# Altium project 4_Layer_GoldenArduino.PrjPcb
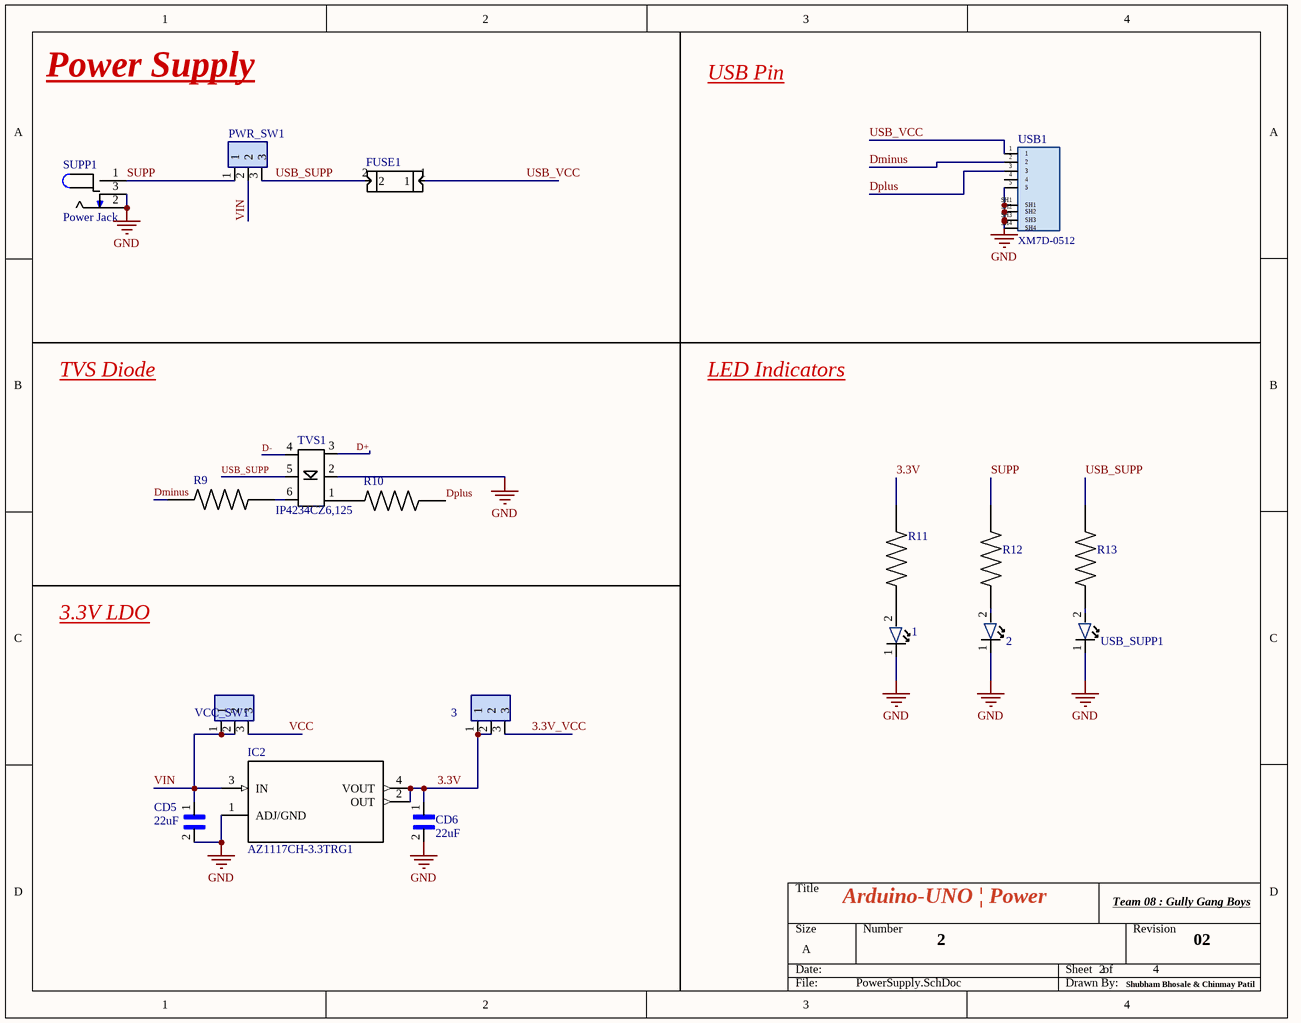
[diagram p0: PowerSupply.SchDoc]
4 sheets, 77 parts. Net scope: global (net labels, ports and power ports of the same name join across sheets).
Board file: PCB.PcbDoc
Sheets:
  PowerSupply.SchDoc
  Atmega328.SchDoc
  FTDIChip.SchDoc
  Sensors.SchDoc

## Sheet PowerSupply.SchDoc
size A

### Parts
1  LTST-C150CKT  [LED]  (value not drawn)
2  LTST-C150CKT  [LED]  (value not drawn)
3  PREC003SAAN-RC  [3_PIN]  (value not drawn)
CD5  22uF  [1206_Passive]
CD6  22uF  [1206_Passive]
FUSE1  MF-MSMF050-2  [FUSE]  (value not drawn)
IC2  AZ1117CH-3.3TRG1  [LDO]
PWR_SW1  PREC003SAAN-RC  [3_PIN]  (value not drawn)
R9  RMCF1206JT300R‎  [1206_Passive]  (value not drawn)
R10  RMCF1206JT300R‎  [1206_Passive]  (value not drawn)
R11  RNCP1206FTD1K00  [1206_Passive]  (value not drawn)
R12  RNCP1206FTD1K00  [1206_Passive]  (value not drawn)
R13  RNCP1206FTD1K00  [1206_Passive]  (value not drawn)
SUPP1  Power Jack  [Power_Jack]
TVS1  IP4234CZ6,125  [TVS]
USB1  XM7D-0512  [USB]
USB_SUPP1  LTST-C150CKT  [LED]  (value not drawn)
VCC_SW1  PREC003SAAN-RC  [3_PIN]  (value not drawn)

### Nets
3.3V_VCC: 3.3
GND: 1.1 2.1 CD5.2 CD6.2 IC2.1(ADJ/GND) SUPP1.2 SUPP1.3 TVS1.2 USB1.5 USB1.SH1 USB1.SH2 USB1.SH3 USB1.SH4 USB_SUPP1.1
VCC: VCC_SW1.3
3.3V: 3.1 3.2 CD6.1 IC2.2(OUT) IC2.4(VOUT) R11.2
D+: TVS1.3
D-: TVS1.4
Dminus: R9.1 USB1.2
Dplus: R10.2 USB1.3
SUPP: PWR_SW1.1 R12.1 SUPP1.1
USB_SUPP: FUSE1.2 PWR_SW1.3 R13.1 TVS1.5
USB_VCC: FUSE1.1 USB1.1
VIN: CD5.1 IC2.3(IN) PWR_SW1.2 VCC_SW1.1 VCC_SW1.2
Net1_2: 1.2 R11.1
Net2_2: 2.2 R12.2
NetR9_2: R9.2 TVS1.6
NetR10_1: R10.1 TVS1.1
NetR13_2: R13.2 USB_SUPP1.2

Not connected (* = marked no-connect by the designer): USB1 4

### Notes on the sheet
- Power Supply
- USB Pin
- TVS Diode
- LED Indicators
- 3.3V LDO
- Arduino-UNO | Power
- Team 08 : Gully Gang Boys
- 2
- 4
- 02
- Shubham Bhosale & Chinmay Patil

### Library data of the parts
1 2 USB_SUPP1 = 1206_RED_LED: Red 638nm LED Indication - Discrete 1.8V 1206 (3216 Metric); Value: LED RED CLEAR 1206 SMD; Digikey Link: https://www.digikey.com/product-detail/en/LTST-C150CKT/160-1167-1-ND/269239/?itemSeq=304982368; Digikey Part: 160-1167-1-ND
3 PWR_SW1 VCC_SW1 = 3_PIN: Connector Header Through Hole 3 position 0.100" (2.54mm); Value: CONN HEADER VERT 3POS 2.54MM; Digikey Link: https://www.digikey.com/product-detail/en/PREC003SAAN-RC/S1012EC-03-ND/2774851/?itemSeq=304982371; Digikey Part: S1012EC-03-ND
CD5 CD6 = 1206_22uF: 22µF ±20% 16V Ceramic Capacitor X5R 1206 (3216 Metric); Value: CAP CER 22UF 16V X5R 1206; Digikey Link: https://www.digikey.com/product-detail/en/CL31A226MOCLNNC/1276-2728-1-ND/3890814/?itemSeq=304982363; Digikey Part: 1276-2728-1-ND
FUSE1 = Fuse: Polymeric PTC Resettable Fuse 15V 500mA Ih Surface Mount 1812 (4532 Metric), Concave; Value: PTC RESET FUSE 15V 500MA 1812; Digikey Link: https://www.digikey.com/product-detail/en/MF-MSMF050-2/MF-MSMF050-2CT-ND/662842/?itemSeq=304982360; Digikey Part: MF-MSMF050-2CT-ND
IC2 = 3.3V_LDO: Linear Voltage Regulator IC Positive Fixed 1 Output 1A SOT-223; Value: IC REG LINEAR 3.3V 800MA SOT223; Digikey Link: https://www.digikey.com/product-detail/en/AZ1117CH-3.3TRG1/AZ1117CH-3.3TRG1DICT-ND/4505206/?itemSeq=304982370; Digikey Part: AZ1117CH-3.3TRG1DICT-ND
R9 R10 = 1206_300Ohm: 300 Ohms ±5% 0.25W, 1/4W Chip Resistor 1206 (3216 Metric) Automotive AEC-Q200 Thick Film; Value: 300Ohm; Digikey Link: https://www.digikey.com/product-detail/en/RMCF1206JT300R/RMCF1206JT300RCT-ND/1942776/?itemSeq=304982374; Digikey Part: RMCF1206JT300RCT-ND
R11-R13 = 1206_1K: 1 kOhms ±1% 0.5W, 1/2W Chip Resistor 1206 (3216 Metric) Anti-Sulfur, Moisture Resistant Thin Film; Value: RES 1K OHM 1% 1/2W 1206; Digikey Link: https://www.digikey.com/product-detail/en/RNCP1206FTD1K00/RNCP1206FTD1K00CT-ND/2240675/?itemSeq=304982373; Digikey Part: RNCP1206FTD1K00CT-ND
SUPP1 = Power Jack: Power Barrel Connector Jack 2.10mm ID (0.083"), 5.50mm OD (0.217") Through Hole, Right Angle; Value: CONN PWR JACK 2X5.5MM SOLDER; Digikey Link: https://www.digikey.com/product-detail/en/PJ-102A/CP-102A-ND/275425/?itemSeq=304982367; Digikey Part: CP-102A-ND
TVS1 = TVS_Diode: Clamp Ipp Tvs Diode Surface Mount 6-TSOP; Value: TVS DIODE 5.5V 6TSOP; Digikey Part: 1727-4717-1-ND; Digikey Link: https://www.digikey.com/product-detail/en/IP4234CZ6%2c125/1727-4717-1-ND/2531156/?itemSeq=304982369
USB1 = USB: USB - mini B USB 2.0 Receptacle Connector 5 Position Through Hole, Right Angle; Value: CONN RCPT USB2.0 MINI B 5P R/A; Digikey Link: https://www.digikey.com/product-detail/en/XM7D-0512/OR1205-ND/4695531/?itemSeq=304982356; Digikey Part: OR1205-ND

## Sheet Atmega328.SchDoc
size A
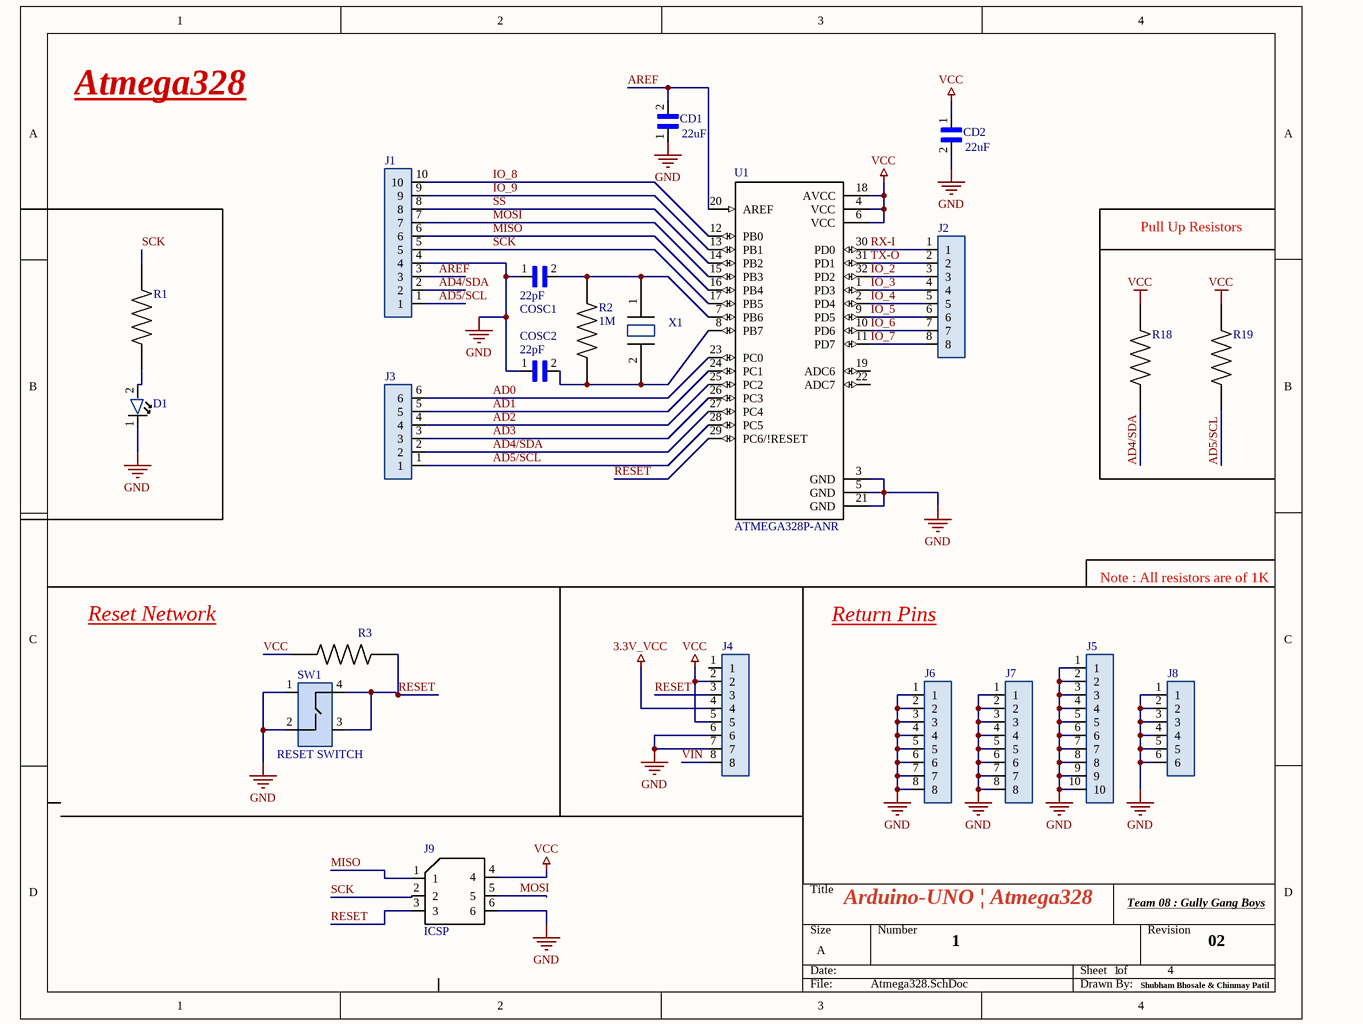
[diagram p1: Atmega328.SchDoc]

### Parts
CD1  22uF  [1206_Passive]
CD2  22uF  [1206_Passive]
COSC1  22pF  [1206_Passive]
COSC2  22pF  [1206_Passive]
D1  LTST-C150CKT  [LED]  (value not drawn)
J1  PPTC101LFBN-RC  [10_PIN]  (value not drawn)
J2  PPTC081LFBN-RC  [8_PIN]  (value not drawn)
J3  PPTC061LFBN-RC  [6_PIN]  (value not drawn)
J4  PPTC081LFBN-RC  [8_PIN]  (value not drawn)
J5  PPTC101LFBN-RC  [10_PIN]  (value not drawn)
J6  PPTC081LFBN-RC  [8_PIN]  (value not drawn)
J7  PPTC081LFBN-RC  [8_PIN]  (value not drawn)
J8  PPTC061LFBN-RC  [6_PIN]  (value not drawn)
J9  ICSP  [ICSP]
R1  RNCP1206FTD1K00  [1206_Passive]  (value not drawn)
R2  1M  [1206_Passive]
R3  RNCP1206FTD1K00  [1206_Passive]  (value not drawn)
R18  RNCP1206FTD1K00  [1206_Passive]  (value not drawn)
R19  RNCP1206FTD1K00  [1206_Passive]  (value not drawn)
SW1  RESET SWITCH  [Switch]
U1  ATMEGA328P-ANR  [ATMega328P]
X1  ABLS-16.000MHZ-B4-T  [Crystal]  (value not drawn)

### Nets
3.3V_VCC: J4.4
GND: CD1.1 CD2.2 COSC1.1 COSC2.1 D1.1 J1.4 J4.6 J4.7 J5.1 J5.2 J5.3 J5.4 J5.5 J5.6 J5.7 J5.8 J5.9 J5.10 J6.1 J6.2 J6.3 J6.4 J6.5 J6.6 J6.7 J6.8 J7.1 J7.2 J7.3 J7.4 J7.5 J7.6 J7.7 J7.8 J8.1 J8.2 J8.3 J8.4 J8.5 J8.6 J9.6 SW1.1 SW1.2 U1.3(GND) U1.5(GND) U1.21(GND)
VCC: CD2.1 J4.2 J4.5 J9.4 R3.1 R18.2 R19.2 U1.4(VCC) U1.6(VCC) U1.18(AVCC)
AD0: J3.6 U1.23(PC0)
AD1: J3.5 U1.24(PC1)
AD2: J3.4 U1.25(PC2)
AD3: J3.3 U1.26(PC3)
AD4/SDA: J1.2 J3.2 R18.1 U1.27(PC4)
AD5/SCL: J1.1 J3.1 R19.1 U1.28(PC5)
AREF: CD1.2 J1.3 U1.20(AREF)
IO_2: J2.3 U1.32(PD2)
IO_3: J2.4 U1.1(PD3)
IO_4: J2.5 U1.2(PD4)
IO_5: J2.6 U1.9(PD5)
IO_6: J2.7 U1.10(PD6)
IO_7: J2.8 U1.11(PD7)
IO_8: J1.10 U1.12(PB0)
IO_9: J1.9 U1.13(PB1)
MISO: J1.6 J9.1 U1.16(PB4)
MOSI: J1.7 J9.5 U1.15(PB3)
RESET: J4.3 J9.3 R3.2 SW1.3 SW1.4 U1.29(PC6/!RESET)
RX-I: J2.1 U1.30(PD0)
SCK: J1.5 J9.2 R1.2 U1.17(PB5)
SS: J1.8 U1.14(PB2)
TX-O: J2.2 U1.31(PD1)
VIN: J4.8
NetCOSC1_2: COSC1.2 R2.2 U1.7(PB6) X1.1
NetCOSC2_2: COSC2.2 R2.1 U1.8(PB7) X1.2
NetD1_2: D1.2 R1.1

Not connected (* = marked no-connect by the designer): J4 1; U1 19(ADC6) 22(ADC7)

### Notes on the sheet
- Atmega328
- Pull Up Resistors
- Reset Network
- Return Pins
- Note : All resistors are of 1K
- Arduino-UNO | Atmega328
- Team 08 : Gully Gang Boys
- 1
- 4
- 02
- Shubham Bhosale & Chinmay Patil

### Library data of the parts
CD1 CD2 = 1206_22uF: as CD5 on sheet PowerSupply; Digikey Link: https://www.digikey.com/product-detail/en/CL31A226MOCLNNC/1276-2728-1-ND/3890814/?itemSeq=304982363; Digikey Part: 1276-2728-1-ND
COSC1 COSC2 = 1206_22pF: 22pF ±5% 16V Ceramic Capacitor C0G, NP0 1206 (3216 Metric); Value: CAP CER 22PF 16V C0G/NP0 1206; Digikey Link: https://www.digikey.com/product-detail/en/885012008011/732-7867-1-ND/5454494/?itemSeq=304982362; Digikey Part: 732-7867-1-ND
D1 = 1206_RED_LED: as 1 on sheet PowerSupply; Digikey Link: https://www.digikey.com/product-detail/en/LTST-C150CKT/160-1167-1-ND/269239/?itemSeq=304982368; Digikey Part: 160-1167-1-ND
J1 J5 = 10_PIN_FEMALE: 10 Position Header Connector 0.100" (2.54mm) Through Hole Tin; Value: CONN HDR 10POS 0.1 TIN PCB; Digikey Link: https://www.digikey.com/product-detail/en/PPTC101LFBN-RC/S7008-ND/810149/?itemSeq=304982352; Digikey Part: S7008-ND
J2 J4 J6 J7 = 8_PIN_FEMALE: 8 Position Header Connector 0.100" (2.54mm) Through Hole Tin; Value: CONN HDR 8POS 0.1 TIN PCB; Digikey Link: https://www.digikey.com/product-detail/en/PPTC081LFBN-RC/S7006-ND/810147/?itemSeq=304982354; Digikey Part: S7006-ND
J3 J8 = 6_PIN_FEMALE: 6 Position Header Connector 0.100" (2.54mm) Through Hole Tin; Value: CONN HDR 6POS 0.1 TIN PCB; Digikey Link: https://www.digikey.com/product-detail/en/PPTC061LFBN-RC/S7004-ND/810145/?itemSeq=304982353; Digikey Part: S7004-ND
J9 = ICSP: Connector Header Through Hole 6 position 0.079" (2.00mm); Value: NRPN032PAEN-RC; Digikey Link: https://www.digikey.com/product-detail/en/NRPN032PAEN-RC/S5801-03-ND/804955/?itemSeq=304982355; Digikey Part: S5801-03-ND
R1 R3 R18 R19 = 1206_1K: as R11 on sheet PowerSupply; Digikey Link: https://www.digikey.com/product-detail/en/RNCP1206FTD1K00/RNCP1206FTD1K00CT-ND/2240675/?itemSeq=304982373; Digikey Part: RNCP1206FTD1K00CT-ND
R2 = 1206_1M: 1 MOhms ±5% 0.25W, 1/4W Chip Resistor 1206 (3216 Metric) Automotive AEC-Q200 Thick Film; Value: RES 1M OHM 5% 1/4W 1206; Digikey Link: https://www.digikey.com/product-detail/en/RMCF1206JT1M00/RMCF1206JT1M00CT-ND/1942830/?itemSeq=304982358; Digikey Part: Number RMCF1206JT1M00CT-ND
SW1 = Push_Button: Tactile Switch SPST-NO Top Actuated Surface Mount; Value: SWITCH TACTILE SPST-NO 50MA 12V; Digikey Link: https://www.digikey.com/product-detail/en/TL3305AF160QG/EG5350CT-ND/5816195/?itemSeq=304982361; Digikey Part: EG5350CT-ND
U1 = ATMega328P: AVR AVR® ATmega Microcontroller IC 8-Bit 20MHz 32KB (16K x 16) FLASH 32-TQFP (7x7); Value: IC MCU 8BIT 32KB FLASH 32TQFP; Digikey Link: https://www.digikey.com/product-detail/en/ATMEGA328P-ANR/ATMEGA328P-ANRCT-ND/2774230/?itemSeq=304982365; Digikey Part: ATMEGA328P-ANRCT-ND
X1 = 16MHz_Crystal: 16MHz ±30ppm Crystal 18pF 40 Ohms HC-49/US; Value: CRYSTAL 16.0000MHZ 18PF SMD; Digikey Link: https://www.digikey.com/product-detail/en/ABLS-16.000MHZ-B4-T/535-10226-1-ND/2184261/?itemSeq=304982364; Digikey Part: 535-10226-1-ND

## Sheet FTDIChip.SchDoc
size A
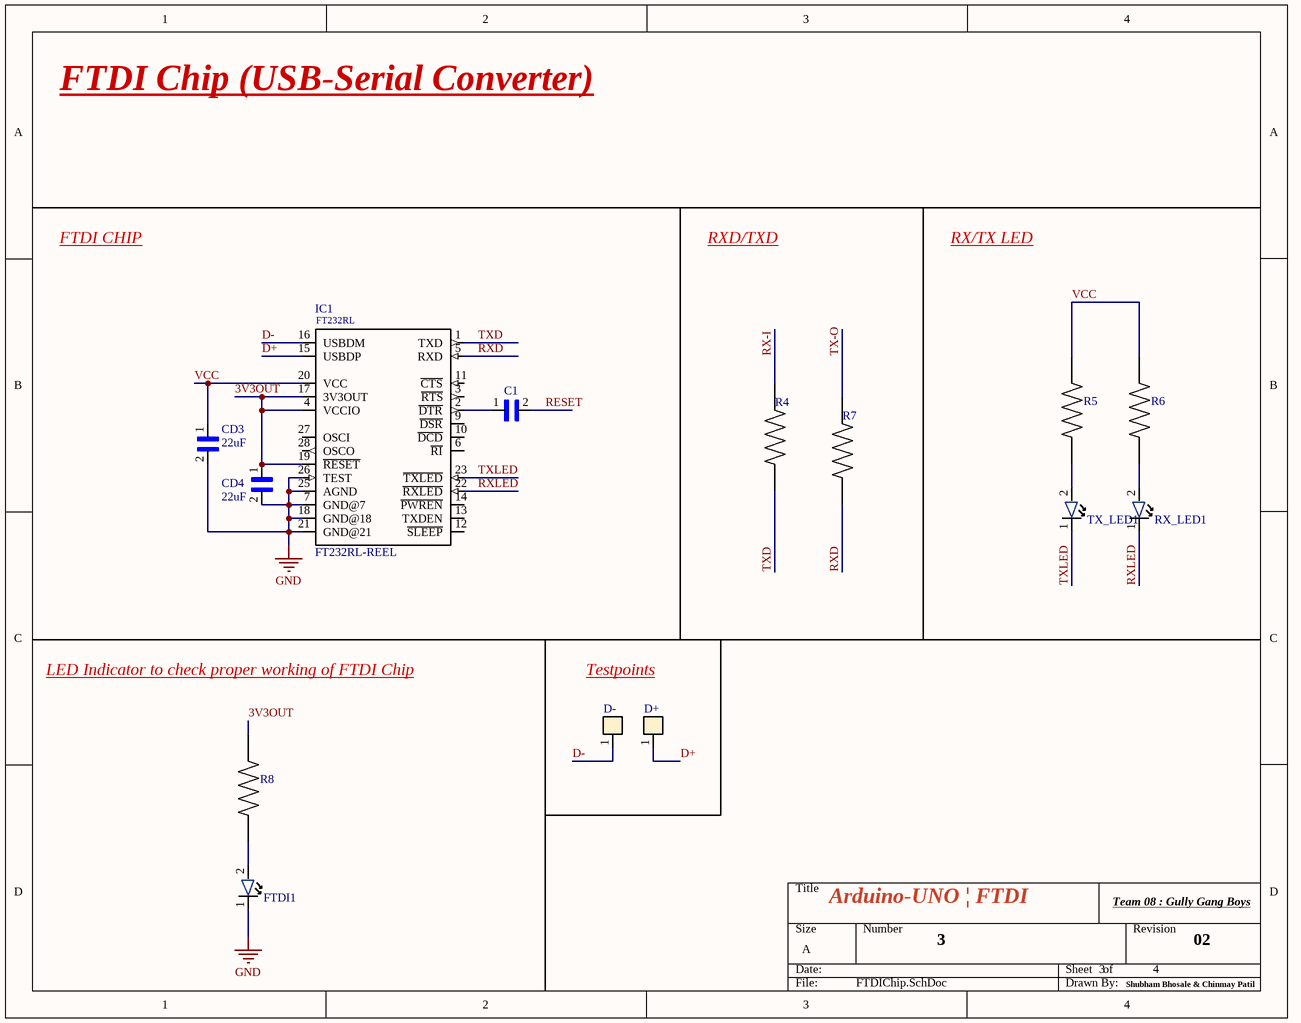
[diagram p2: FTDIChip.SchDoc]

### Parts
C1  CL31A226MOCLNNC  [1206_Passive]  (value not drawn)
CD3  22uF  [1206_Passive]
CD4  22uF  [1206_Passive]
D+  TESTPOINT  [TestPoint]  (value not drawn)
D-  TESTPOINT  [TestPoint]  (value not drawn)
FTDI1  LTST-C150CKT  [LED]  (value not drawn)
IC1  FT232RL-REEL  [FTDI]
R4  RNCP1206FTD1K00  [1206_Passive]  (value not drawn)
R5  RNCP1206FTD1K00  [1206_Passive]  (value not drawn)
R6  RNCP1206FTD1K00  [1206_Passive]  (value not drawn)
R7  RNCP1206FTD1K00  [1206_Passive]  (value not drawn)
R8  RNCP1206FTD1K00  [1206_Passive]  (value not drawn)
RX_LED1  LTST-C150CKT  [LED]  (value not drawn)
TX_LED1  LTST-C150CKT  [LED]  (value not drawn)

### Nets
GND: CD3.2 CD4.2 FTDI1.1 IC1.7(GND@7) IC1.18(GND@18) IC1.21(GND@21) IC1.25(AGND) IC1.26(TEST)
VCC: CD3.1 IC1.20(VCC) R5.1 R6.1
3V3OUT: CD4.1 IC1.4(VCCIO) IC1.17(3V3OUT) IC1.19(~{RESET}) R8.1
D+: D+.1 IC1.15(USBDP)
D-: D-.1 IC1.16(USBDM)
RESET: C1.2
RX-I: R4.2
RXD: IC1.5(RXD) R7.1
RXLED: IC1.22(~{RXLED}) RX_LED1.1
TX-O: R7.2
TXD: IC1.1(TXD) R4.1
TXLED: IC1.23(~{TXLED}) TX_LED1.1
NetC1_1: C1.1 IC1.2(~{DTR})
NetFTDI1_2: FTDI1.2 R8.2
NetR5_2: R5.2 TX_LED1.2
NetR6_2: R6.2 RX_LED1.2

Not connected (* = marked no-connect by the designer): IC1 3(~{RTS}) 6(~{RI}) 9(~{DSR}) 10(~{DCD}) 11(~{CTS}) 12(~{SLEEP}) 13(TXDEN) 14(~{PWREN}) 27(OSCI) 28(OSCO)

### Notes on the sheet
- FTDI Chip (USB-Serial Converter)
- FTDI CHIP
- RXD/TXD
- RX/TX LED
- LED Indicator to check proper working of FTDI Chip
- Testpoints
- Arduino-UNO | FTDI
- Team 08 : Gully Gang Boys
- 3
- 4
- 02
- Shubham Bhosale & Chinmay Patil
- (in symbol FTDI) FT232RL

### Library data of the parts
C1 CD3 CD4 = 1206_22uF: as CD5 on sheet PowerSupply; Digikey Link: https://www.digikey.com/product-detail/en/CL31A226MOCLNNC/1276-2728-1-ND/3890814/?itemSeq=304982363; Digikey Part: 1276-2728-1-ND
FTDI1 RX_LED1 TX_LED1 = 1206_RED_LED: as 1 on sheet PowerSupply; Digikey Link: https://www.digikey.com/product-detail/en/LTST-C150CKT/160-1167-1-ND/269239/?itemSeq=304982368; Digikey Part: 160-1167-1-ND
IC1 = FTDI: USB Bridge, USB to UART USB 2.0 UART Interface 28-SSOP; Value: IC USB FS SERIAL UART 28-SSOP; Digikey Part: 768-1007-1-ND; Digikey Link: https://www.digikey.com/product-detail/en/FT232RL-REEL/768-1007-1-ND/1836402/?itemSeq=304982359
R4-R8 = 1206_1K: as R11 on sheet PowerSupply; Digikey Link: https://www.digikey.com/product-detail/en/RNCP1206FTD1K00/RNCP1206FTD1K00CT-ND/2240675/?itemSeq=304982373; Digikey Part: RNCP1206FTD1K00CT-ND

## Sheet Sensors.SchDoc
size A
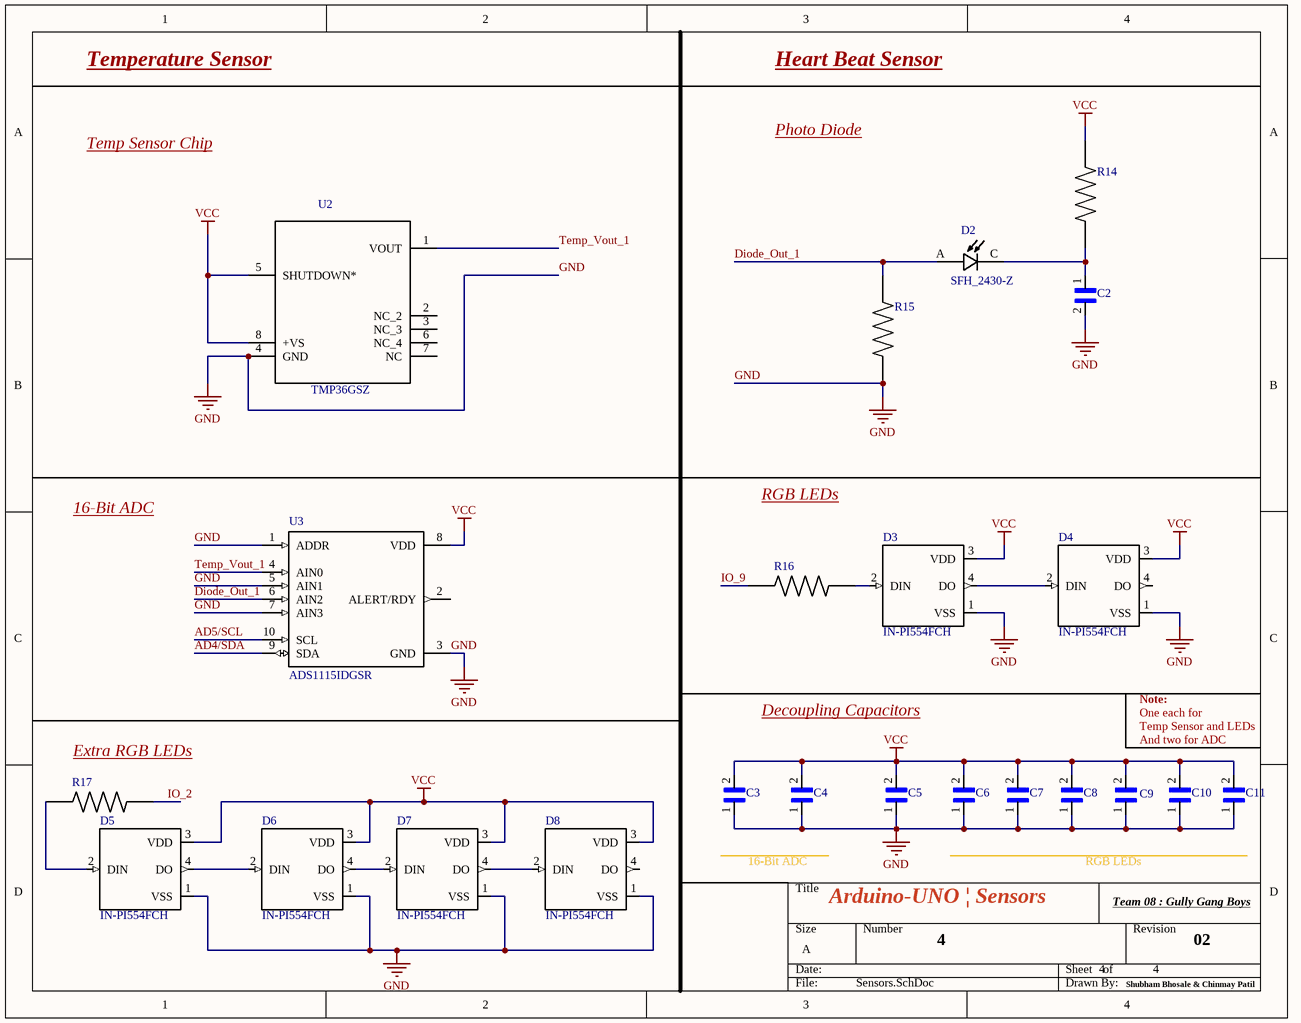
[diagram p3: Sensors.SchDoc]

### Parts
C2  CL31A226MOCLNNC  [1206_Passive]  (value not drawn)
C3  CL31A226MOCLNNC  [1206_Passive]  (value not drawn)
C4  CL31A226MOCLNNC  [1206_Passive]  (value not drawn)
C5  CL31A226MOCLNNC  [1206_Passive]  (value not drawn)
C6  CL31A226MOCLNNC  [1206_Passive]  (value not drawn)
C7  CL31A226MOCLNNC  [1206_Passive]  (value not drawn)
C8  CL31A226MOCLNNC  [1206_Passive]  (value not drawn)
C9  CL31A226MOCLNNC  [1206_Passive]  (value not drawn)
C10  CL31A226MOCLNNC  [1206_Passive]  (value not drawn)
C11  CL31A226MOCLNNC  [1206_Passive]  (value not drawn)
D2  SFH_2430-Z  [*DIO_SFH_2430-Z_SFH_2430-Z(Primary)]
D3  IN-PI554FCH  [*LED_IN-PI554FCH]
D4  IN-PI554FCH  [*LED_IN-PI554FCH]
D5  IN-PI554FCH  [*LED_IN-PI554FCH]
D6  IN-PI554FCH  [*LED_IN-PI554FCH]
D7  IN-PI554FCH  [*LED_IN-PI554FCH]
D8  IN-PI554FCH  [*LED_IN-PI554FCH]
R14  RNCP1206FTD1K00  [1206_Passive]  (value not drawn)
R15  RMCF1206JT1M00  [1206_Passive]  (value not drawn)
R16  RNCP1206FTD1K00  [1206_Passive]  (value not drawn)
R17  RNCP1206FTD1K00  [1206_Passive]  (value not drawn)
U2  TMP36GSZ  [*SOIC127P600X175-8N]
U3  ADS1115IDGSR  [*SOP50P490X110-10N]

### Nets
GND: C2.2 C3.1 C4.1 C5.1 C6.1 C7.1 C8.1 C9.1 C10.1 C11.1 D3.1(VSS) D4.1(VSS) D5.1(VSS) D6.1(VSS) D7.1(VSS) D8.1(VSS) R15.2 U2.4(GND) U3.1(ADDR) U3.3(GND) U3.5(AIN1) U3.7(AIN3)
VCC: C3.2 C4.2 C5.2 C6.2 C7.2 C8.2 C9.2 C10.2 C11.2 D3.3(VDD) D4.3(VDD) D5.3(VDD) D6.3(VDD) D7.3(VDD) D8.3(VDD) R14.2 U2.5(SHUTDOWN*) U2.8(+VS) U3.8(VDD)
AD4/SDA: U3.9(SDA)
AD5/SCL: U3.10(SCL)
Diode_Out_1: D2.A R15.1 U3.6(AIN2)
IO_2: R17.2
IO_9: R16.1
Temp_Vout_1: U2.1(VOUT) U3.4(AIN0)
NetC2_1: C2.1 D2.C R14.1
NetD3_2: D3.2(DIN) R16.2
NetD3_4: D3.4(DO) D4.2(DIN)
NetD5_2: D5.2(DIN) R17.1
NetD5_4: D5.4(DO) D6.2(DIN)
NetD6_4: D6.4(DO) D7.2(DIN)
NetD7_4: D7.4(DO) D8.2(DIN)

Not connected (* = marked no-connect by the designer): D4 4(DO); D8 4(DO); U2 2(NC_2) 3(NC_3) 6(NC_4) 7(NC); U3 2(ALERT/RDY)

### Notes on the sheet
- Temperature Sensor
- Heart Beat Sensor
- Temp Sensor Chip
- Photo Diode
- RGB LEDs
- 16-Bit ADC
- Note:
- (near R17) Extra RGB LEDs
- Decoupling Capacitors
- Temp Sensor and LEDs
- And two for ADC
- One each for
- Arduino-UNO | Sensors
- Team 08 : Gully Gang Boys
- 4
- 02
- Shubham Bhosale & Chinmay Patil

### Library data of the parts
C2-C11 = 1206_22uF: as CD5 on sheet PowerSupply; Digikey Link: https://www.digikey.com/product-detail/en/CL31A226MOCLNNC/1276-2728-1-ND/3890814/?itemSeq=304982363; Digikey Part: 1276-2728-1-ND
D2 = SFH_2430-Z: PHOTODIODE 570NM SMD; MF: OSRAM Opto; MP: SFH 2430-Z; SnapEDA_Link: https://www.snapeda.com/parts/SFH%202430-Z/OSRAM%20Opto%20Semiconductors%20Inc./view-part/?ref=snap; Price: None; Package: SMD-2 Osram Opto; Availability: Unavailable; Value: *
D3-D8 = IN-PI554FCH: / 5050RGB with integrated IC built in 4 PIN Â•Viewing angle: 120 degrees /; MF: Inolux; Package: SMD-4 Innolux; MP: IN-PI554FCH; Price: None; Availability: Unavailable; SnapEDA_Link: https://www.snapeda.com/parts/IN-PI554FCH/Inolux/view-part/?ref=snap; Value: *
R14 R16 R17 = 1206_1K: as R11 on sheet PowerSupply; Digikey Link: https://www.digikey.com/product-detail/en/RNCP1206FTD1K00/RNCP1206FTD1K00CT-ND/2240675/?itemSeq=304982373; Digikey Part: RNCP1206FTD1K00CT-ND
R15 = 1206_1M: as R2 on sheet Atmega328; Digikey Link: https://www.digikey.com/product-detail/en/RMCF1206JT1M00/RMCF1206JT1M00CT-ND/1942830/?itemSeq=304982358; Digikey Part: Number RMCF1206JT1M00CT-ND
U2 = TMP36GSZ: Temp Sensor Analog_Voltage_ Serial _2-Wire_ 8-Pin SOIC N Tube; MF: Analog Devices; MP: TMP36GSZ; Package: SOIC-8 Analog Devices; Price: None; SnapEDA_Link: https://www.snapeda.com/parts/TMP36GSZ/Analog%20Devices%20Inc./view-part/?ref=snap; Availability: Unavailable; Value: *
U3 = ADS1115IDGSR: 16-Bit ADC with Integrated MUX, PGA, Comparator, Oscillator, and Reference 10-VSSOP -40 to 125; MF: Texas Instruments; MP: ADS1115IDGSR; Package: MSOP-10 Texas Instruments; SnapEDA_Link: https://www.snapeda.com/parts/ADS1115IDGSR/Texas%20Instruments/view-part/?ref=snap; Digi-Key_Part_Number: 296-38849-1-ND; Digi-Key_Purchase_URL: https://www.digikey.com/product-detail/en/texas-instruments/ADS1115IDGSR/296-38849-1-ND/5142969?utm_source=snapeda&utm_medium=aggregator&utm_campaign=symbol; Value: *

## Nets that join several sheets
3.3V_VCC: PowerSupply (3.3), Atmega328 (J4.4)
GND: PowerSupply (14 pins), Atmega328 (46 pins), FTDIChip (8 pins), Sensors (22 pins)
VCC: PowerSupply (VCC_SW1.3), Atmega328 (10 pins), FTDIChip (CD3.1 IC1.20 R5.1 R6.1), Sensors (19 pins)
AD4/SDA: Atmega328 (J1.2 J3.2 R18.1 U1.27), Sensors (U3.9)
AD5/SCL: Atmega328 (J1.1 J3.1 R19.1 U1.28), Sensors (U3.10)
D+: PowerSupply (TVS1.3), FTDIChip (D+.1 IC1.15)
D-: PowerSupply (TVS1.4), FTDIChip (D-.1 IC1.16)
IO_2: Atmega328 (J2.3 U1.32), Sensors (R17.2)
IO_9: Atmega328 (J1.9 U1.13), Sensors (R16.1)
RESET: Atmega328 (6 pins), FTDIChip (C1.2)
RX-I: Atmega328 (J2.1 U1.30), FTDIChip (R4.2)
TX-O: Atmega328 (J2.2 U1.31), FTDIChip (R7.2)
VIN: PowerSupply (5 pins), Atmega328 (J4.8)